# EAGLE design dnc (EAGLE 7.1.0)
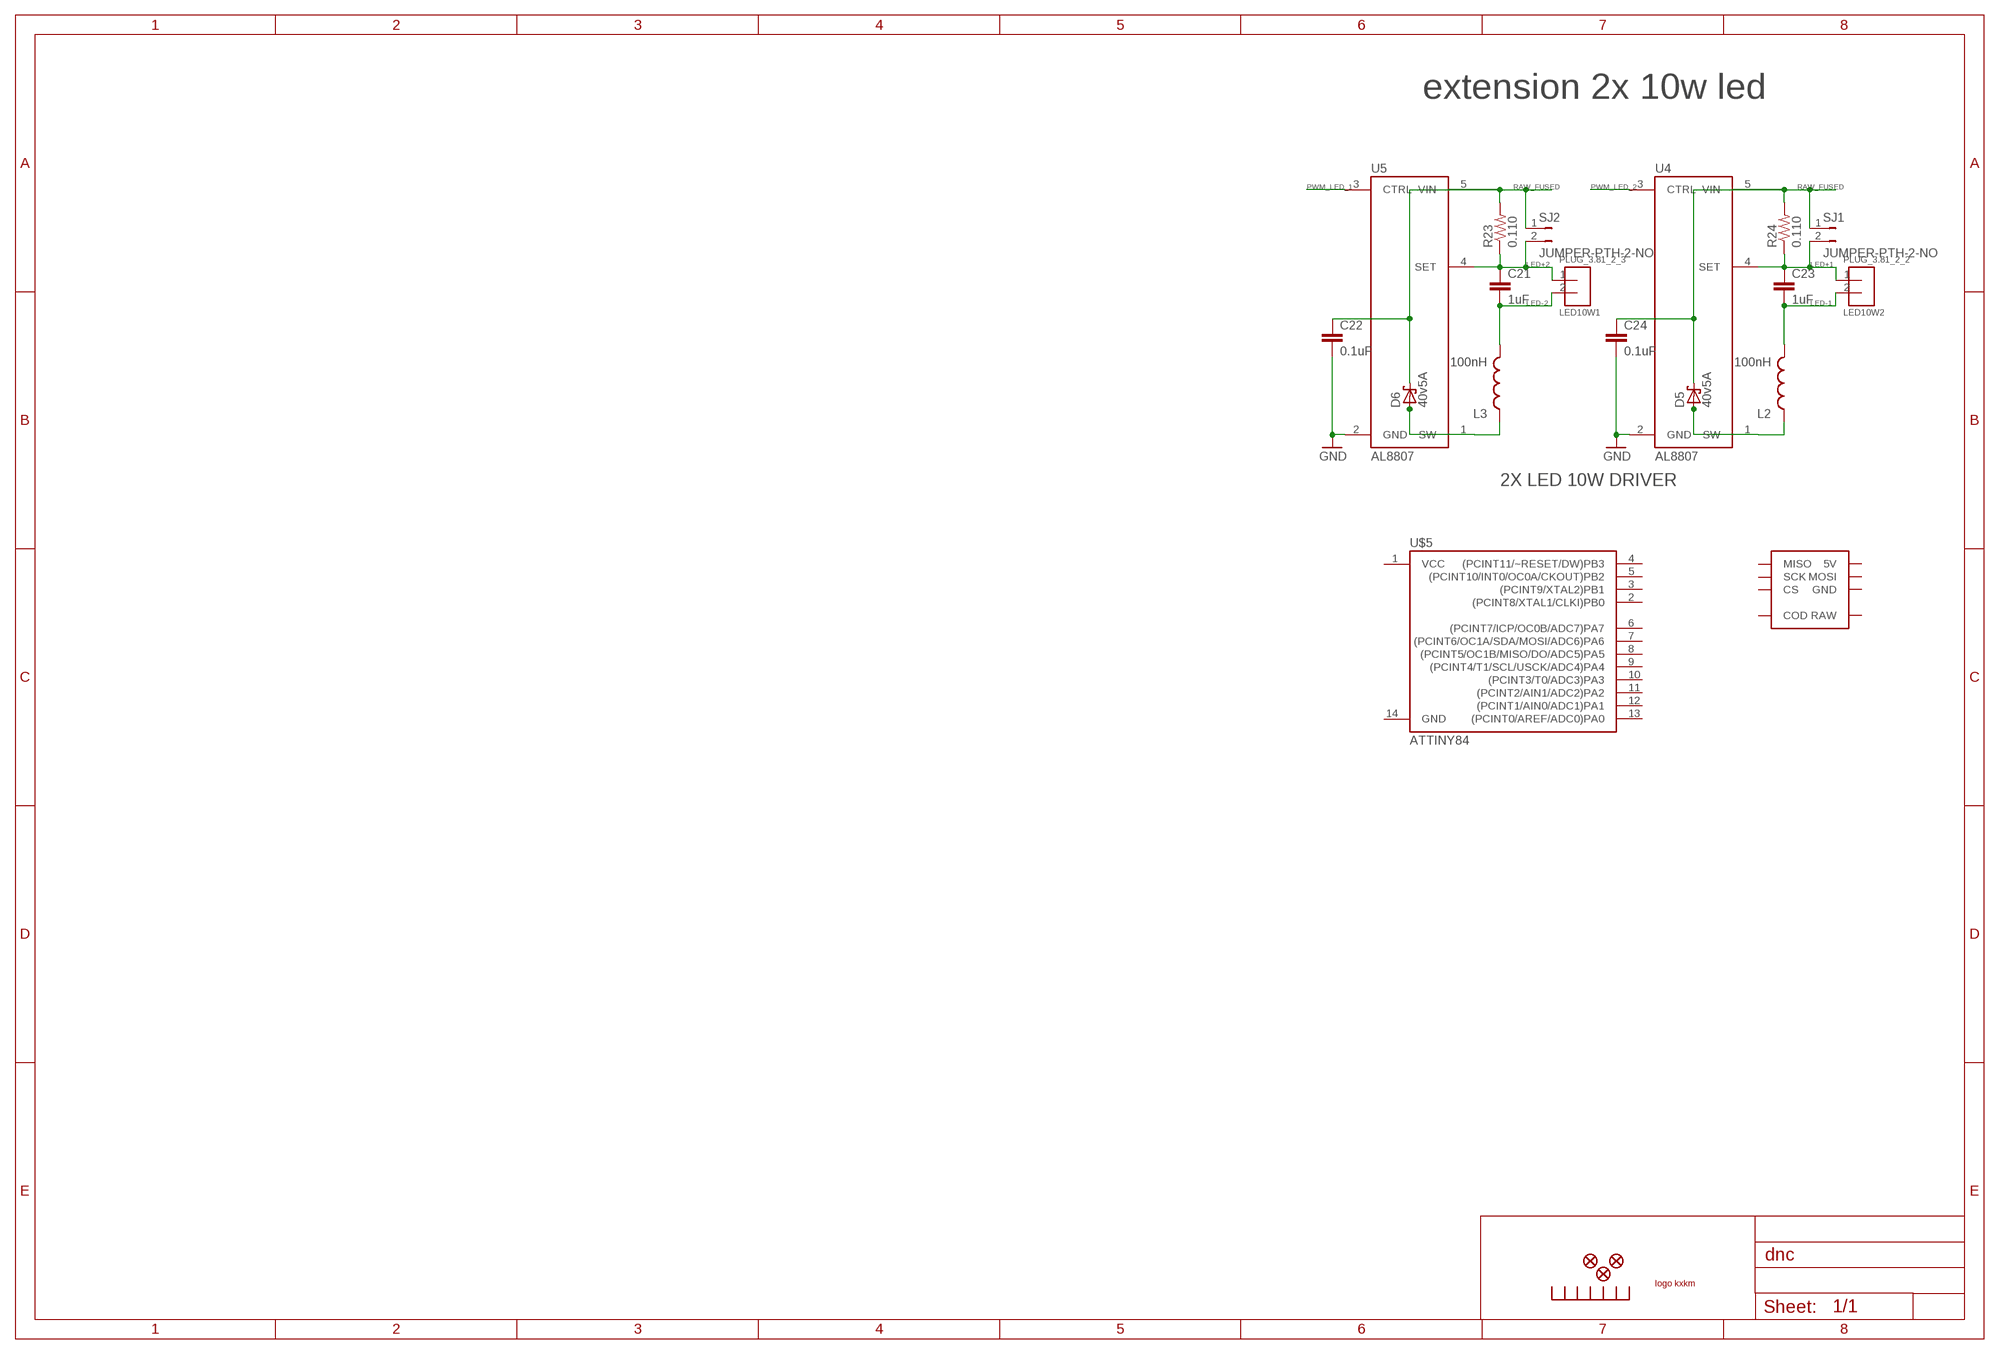
[diagram p0: schematic, sheet 1]

## Parts
C21  1uF  C-EUC0603  [C0603]
C22  0.1uF  C-EUC0603  [C0603]
C23  1uF  C-EUC0603  [C0603]
C24  0.1uF  C-EUC0603  [C0603]
D5  40v5A  SCHOTTKY-DIODESMC  [SMC]
D6  40v5A  SCHOTTKY-DIODESMC  [SMC]
JP13  FIDUCIAL1X2.5  [FIDUCIAL-1X2.5]
JP14  FIDUCIAL1X2.5  [FIDUCIAL-1X2.5]
JP19  FIDUCIAL1X2.5  [FIDUCIAL-1X2.5]
L2  100nH  INDUCTORPWR  [CDRH125]
L3  100nH  INDUCTORPWR  [CDRH125]
PLUG_3.81_2_2  LED10W2  M02PLUG  [PLUG_02]
PLUG_3.81_2_3  LED10W1  M02PLUG  [PLUG_02]
R23  0.110  RESISTOR0603-RES  [0603-RES]
R24  0.110  RESISTOR0603-RES  [0603-RES]
SJ1  JUMPER-PTH-2-NO  [PTH-JUMPER-2-NO_NO_SILK]
SJ2  JUMPER-PTH-2-NO  [PTH-JUMPER-2-NO_NO_SILK]
U4  AL8807  AL8805  [SOT23-5]
U5  AL8807  AL8805  [SOT23-5]
U$1  RADIATEUR  [RADIATEUR_577102B00000G]
U$2  LOGO  [KXKMLOGO]
U$5  ATTINY84  [SO14]
U$6  EXT-DNCCARTE_EXTENSION  [2X5_RIGHTANGLEDNC]

## Nets
GND [GND]: C22.2 C24.2 U4.2(GND) U5.2(GND)
LED+1 [5V]: C23.1 PLUG_3.81_2_2.1 R24.1 SJ1.2 U4.4(SET)
LED+2 [5V]: C21.1 PLUG_3.81_2_3.1 R23.1 SJ2.2 U5.4(SET)
LED-1 [5V]: C23.2 L2.2 PLUG_3.81_2_2.2
LED-2 [5V]: C21.2 L3.2 PLUG_3.81_2_3.2
N$22: D5.A L2.1 U4.1(SW)
N$23: D6.A L3.1 U5.1(SW)
PWM_LED_1: U5.3(CTRL)
PWM_LED_2: U4.3(CTRL)
RAW_FUSED [5V]: C22.1 C24.1 D5.C D6.C R23.2 R24.2 SJ1.1 SJ2.1 U4.5(VIN) U5.5(VIN)
Unconnected: U$5.1(VCC) U$5.2((PCINT8/XTAL1/CLKI)PB0) U$5.3((PCINT9/XTAL2)PB1) U$5.4((PCINT11/~RESET/DW)PB3) U$5.5((PCINT10/INT0/OC0A/CKOUT)PB2) U$5.6((PCINT7/ICP/OC0B/ADC7)PA7) U$5.7((PCINT6/OC1A/SDA/MOSI/ADC6)PA6) U$5.8((PCINT5/OC1B/MISO/DO/ADC5)PA5) U$5.9((PCINT4/T1/SCL/USCK/ADC4)PA4) U$5.10((PCINT3/T0/ADC3)PA3) U$5.11((PCINT2/AIN1/ADC2)PA2) U$5.12((PCINT1/AIN0/ADC1)PA1) U$5.13((PCINT0/AREF/ADC0)PA0) U$5.14(GND) U$6.5V U$6./CS(CS) U$6.GND U$6.GND2(GND) U$6.MISO U$6.MOSI U$6.RAW U$6.RAW2(RAW) U$6.RETOURANALOG(COD) U$6.SCK

## Notes on the sheet
- extension 2x 10w led
- 2X LED 10W DRIVER

## Library data of the parts
C21-C24 = rcl:C-EU: CAPACITOR, European symbol
D5 D6 = diode:SCHOTTKY-DIODE: Schottky Diode
JP13 JP14 JP19 = SparkFun:FIDUCIAL: Fiducial Alignment Points Various fiducial points for machine vision alignment.
L2 L3 = SparkFun:INDUCTOR: Inductors Basic Inductor/Choke - 0603 and 1206. Footprints are not proven and vary greatly between part numbers.
PLUG_3.81_2_2 PLUG_3.81_2_3 = pierre_vv:M02
R23 R24 = SparkFun-Passives:RESISTOR: Resistor Basic schematic elements and footprints for 0603, 1206, and PTH resistors.
SJ1 SJ2 = SparkFun-Passives:JUMPER-PTH-2-NO
U4 U5 = SparkFun-PowerIC:AL8805: Constant current LED driver PWM-able 1MHz switch freq 6V-36V Up to 1A LED current; PROD_ID: IC-11626; VALUE: AL8805WS
U$1 = pierre_vv:RADIATEUR
U$2 = pierre_vv:LOGO
U$5 = SparkFun-DigitalIC:ATTINY84: Atmel 14-pin 2/4/8kB flash uC; PROD_ID: IC-11285
U$6 = pierre_vv:EXT-DNC

## Net classes
0 default: width 0.203 mm
1 GND: width 0.254 mm
2 3.3V: width 0.203 mm
3 5V: width 0.305 mm
4 230AC: width 0.61 mm, clearance 0.305 mm

## Board
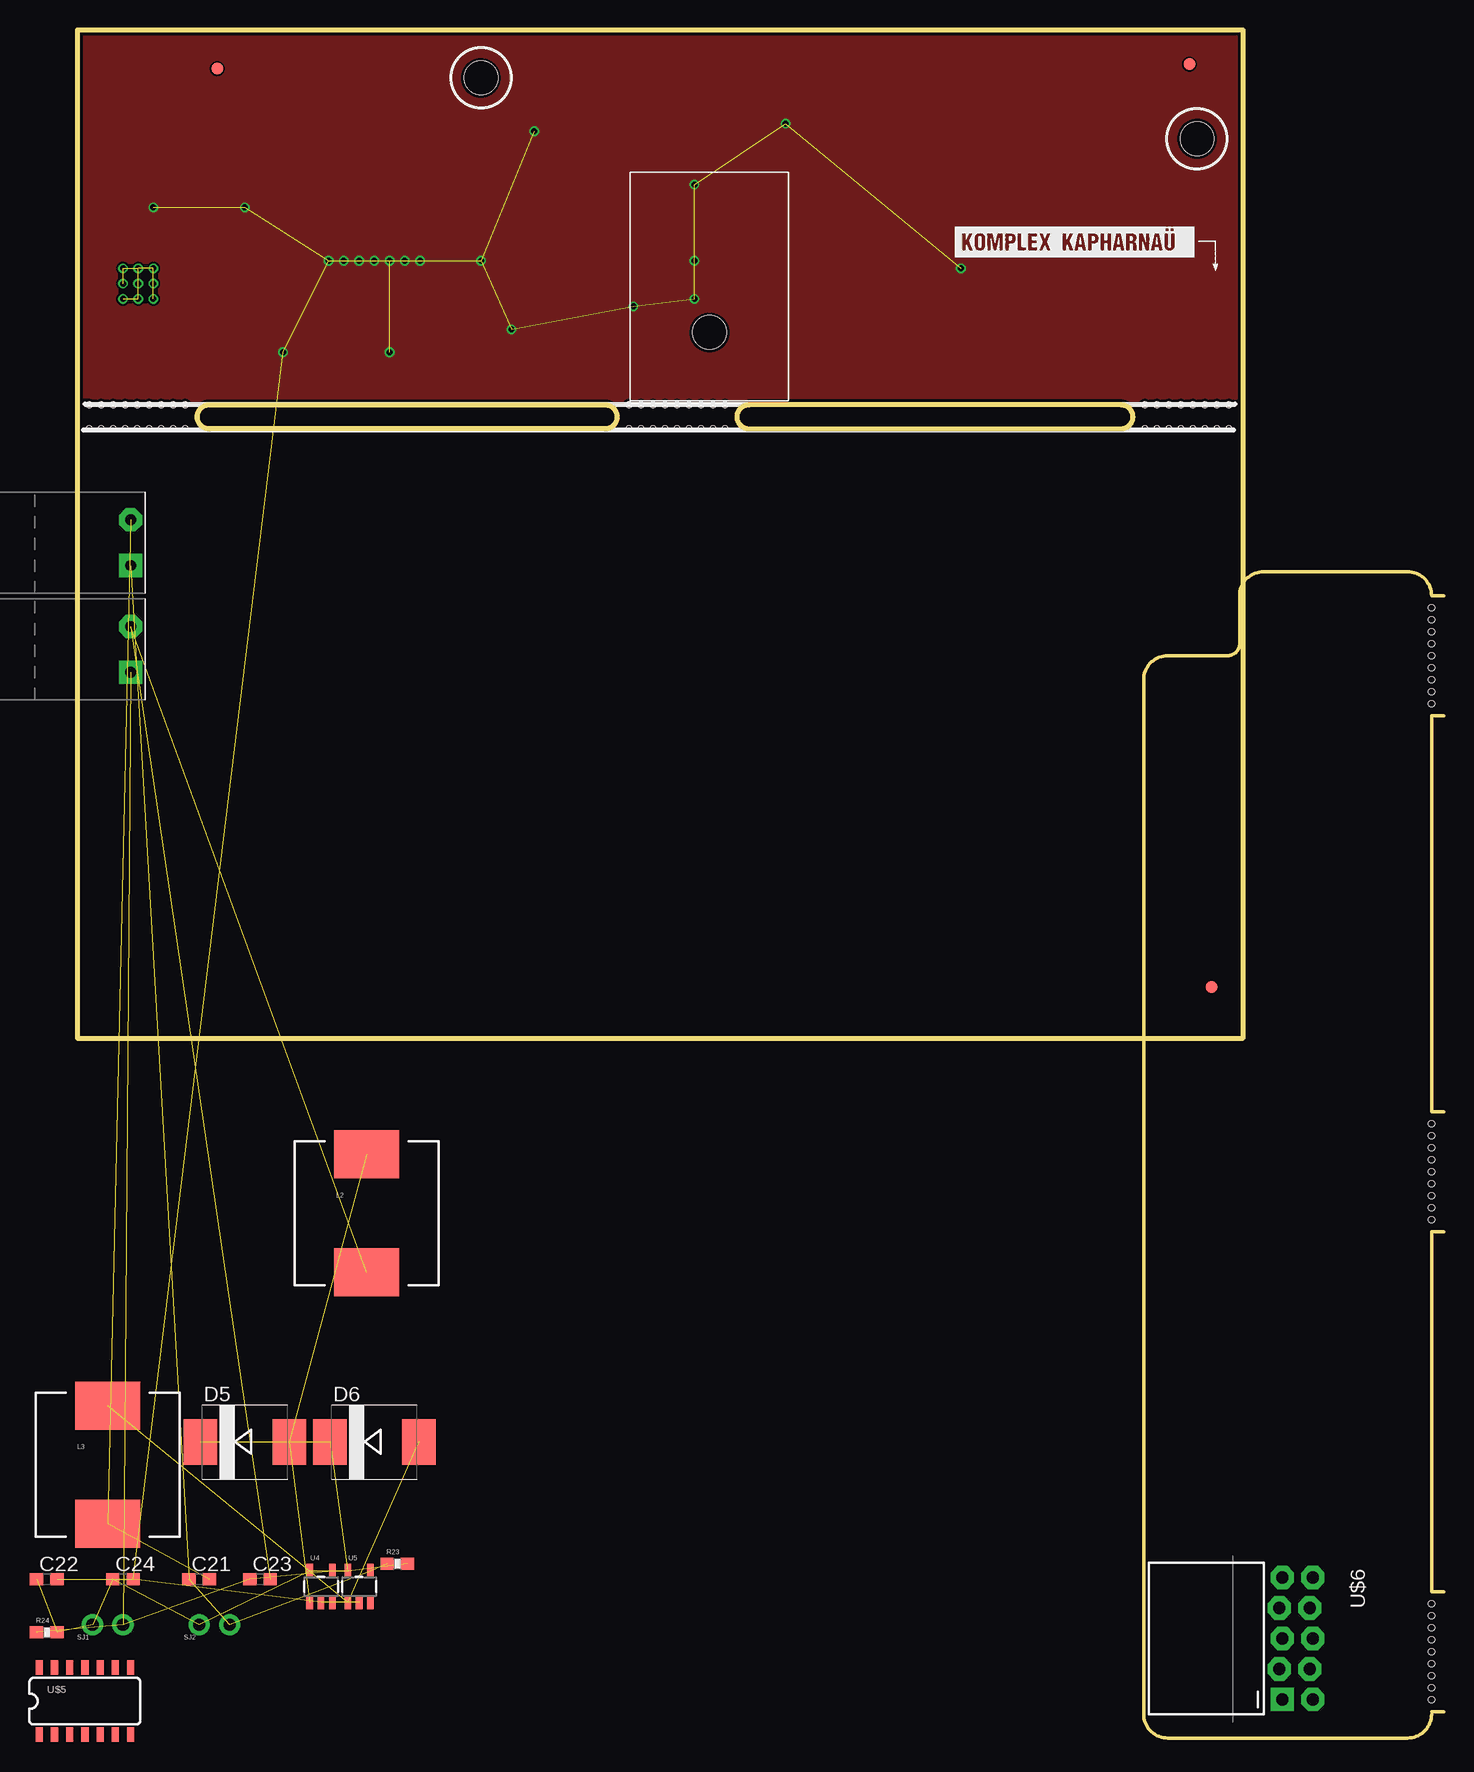
[diagram p1: board, top side]
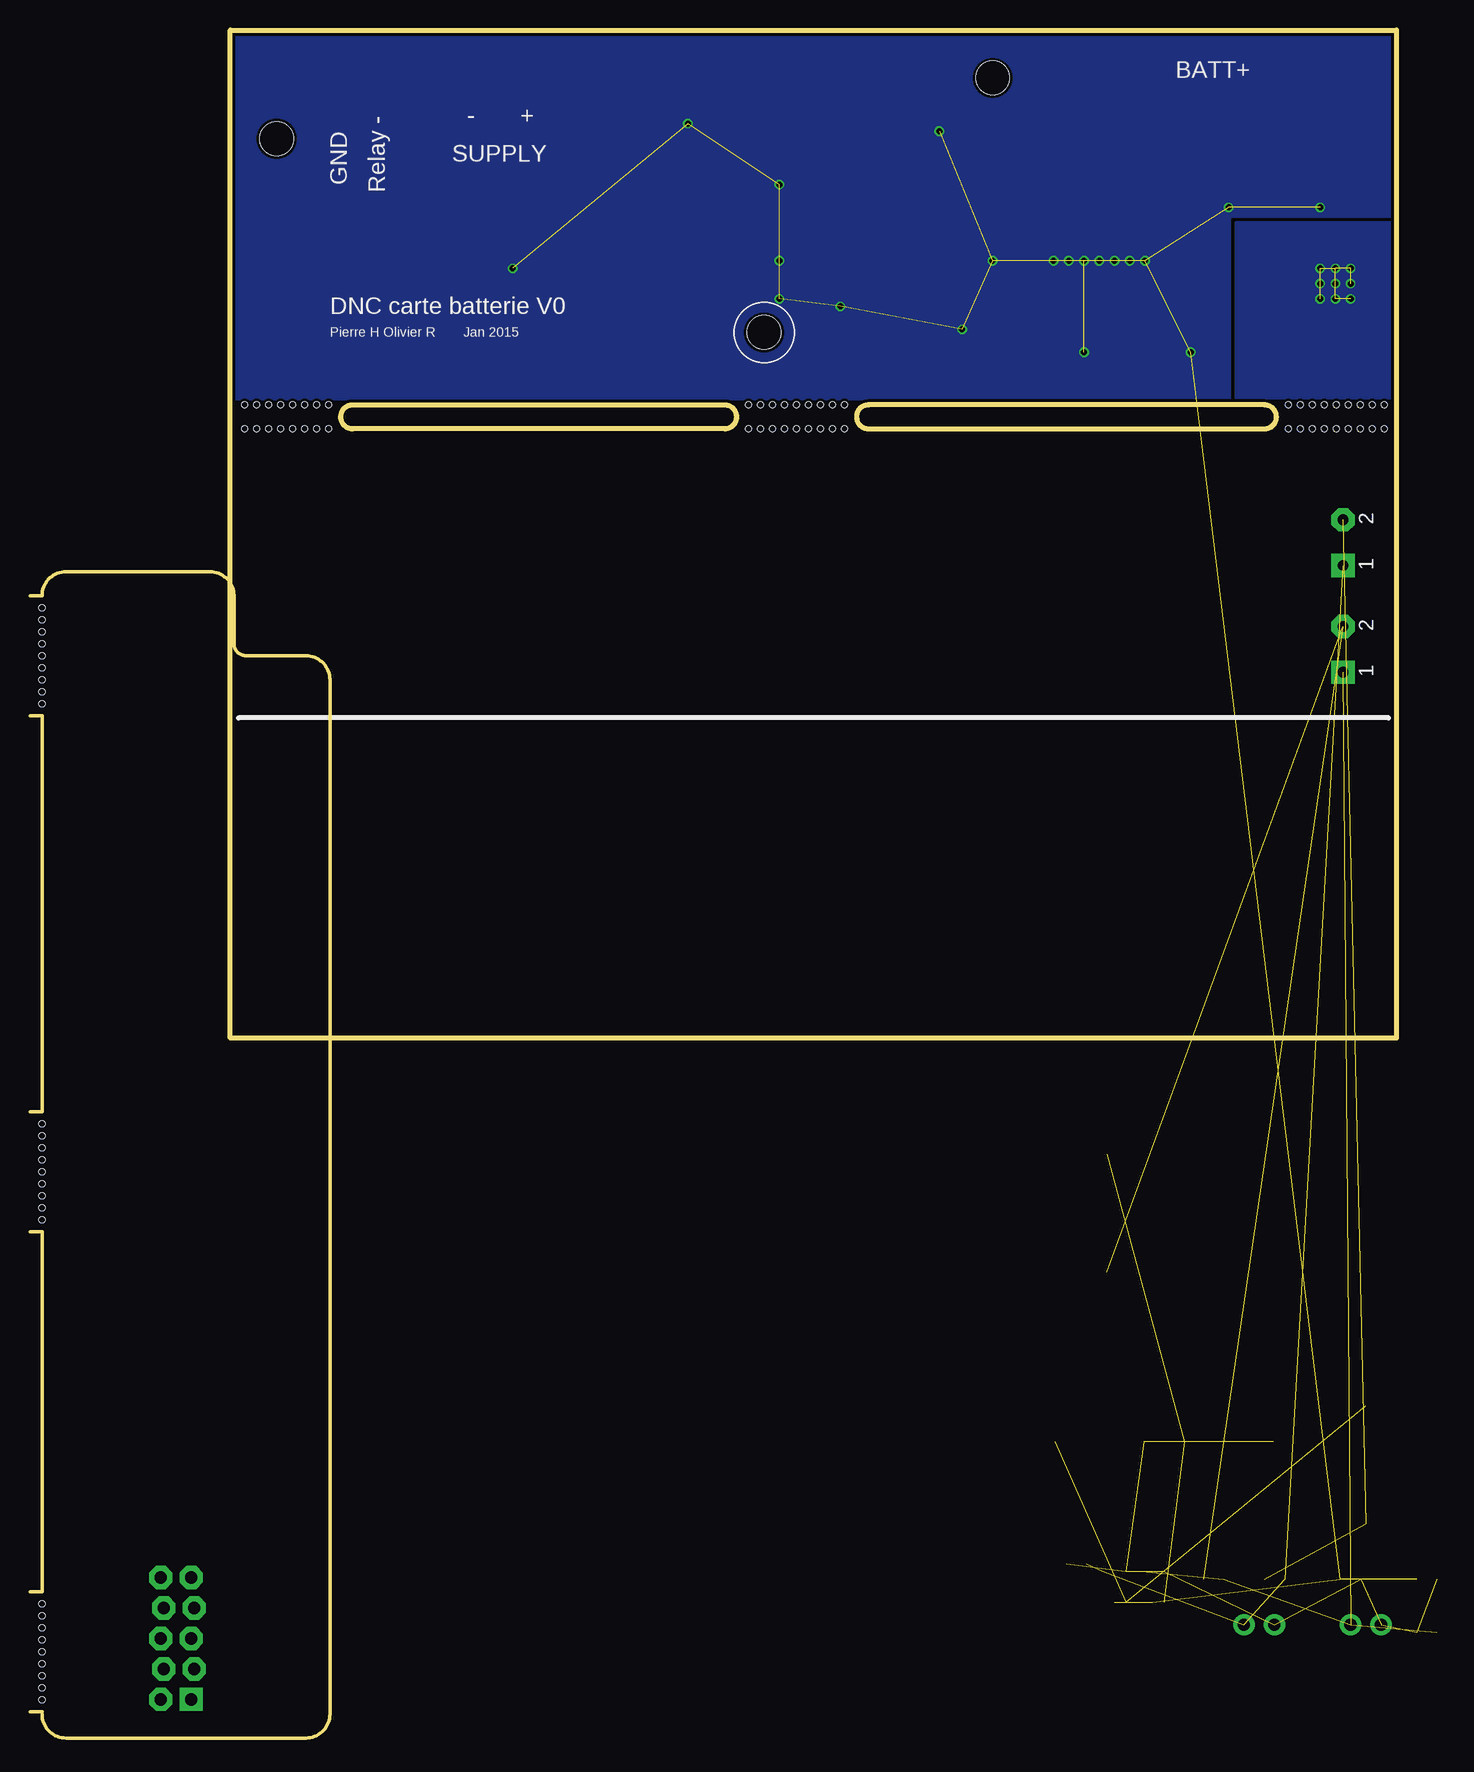
[diagram p2: board, bottom side, seen from below]

Size 113.9 x 142.34 mm. Coordinates in mm from the lower left corner, seen from the top.
Outline: 0,142.34 0,58.34 97.2,58.34 97.2,142.34 0,142.34
Outline: 11,111.1 44,111.1 arc-90 45,110.1 arc-90 44,109.1 11,109.1 arc-90 10,110.1 arc-90 11,111.1
Outline: 56,109.1 87,109.1 arc90 88,110.1 arc90 87,111.1 56,111.1 arc90 55,110.1 arc90 56,109.1
Copper layers (1*16): Top 0.035mm / dielectric 1.5mm / Bottom 0.035mm
Design rules "SeeedStudio_2layer_DRU_no_angle_20140221 *": minimum track width 6mil, minimum drill 12mil, track to track 6mil, track to pad 6mil, pad to pad 6mil, via to via 6mil, smd to smd 0mil, copper to edge 10mil, drill to drill 10mil, minimum pad ring 12mil, minimum via ring 6mil, stop-mask expansion 2mil, vias tented up to drill 100mil, thermal gap 10mil
Holes 2.8 mm at 33.66,138.35 93.34,133.27
Holes 0.5 mm at 9,109.1 8,109.1 7,109.1 7,109.1 6,109.1 5,109.1 4,109.1 3,109.1 2,109.1 1,109.1 1,111.1 2,111.1 3,111.1 4,111.1 5,111.1 6,111.1 7,111.1 8,111.1 9,111.1 46,111.1 48,111.1 47,111.1 49,111.1 50,111.1 51,111.1 52,111.1 53,111.1 54,111.1 54,109.1 53,109.1 52,109.1 51,109.1 50,109.1 49,109.1 48,109.1 47,109.1 46,109.1 96,109.1 95,109.1 94,109.1 93,109.1 92,109.1 91,109.1 90,109.1 89,109.1 89,111.1 90,111.1 91,111.1 92,111.1 93,111.1 94,111.1 95,111.1 96,111.1

### Footprints (pad centres in the part's own frame; a part is rotated, then mirrored left to right if it is on the bottom)
C0603 = smd 1.1 x 1: 1 -0.85,0; 2 0.85,0
SMC = smd 2.8 x 3.8: A 3.7,0; C -3.7,0
FIDUCIAL-1X2.5 = smd 1 x 1: 1 0,0
CDRH125 = smd 5.4 x 4: 1 0,4.9; 2 0,-4.9
PLUG_02 = drill 0.9 pad 1.93 square: 1 -1.905,0 | drill 0.9 pad 1.93 octagon: 2 1.905,0
0603-RES = smd 1.1 x 1: 1 -0.85,0; 2 0.85,0
PTH-JUMPER-2-NO_NO_SILK = drill 1.016 pad 1.778: 1 -1.27,0; 2 1.27,0
SOT23-5 = smd 0.55 x 1.2: 1 -0.95,-1.3; 2 0,-1.3; 3 0.95,-1.3; 4 0.95,1.3; 5 -0.95,1.3
RADIATEUR_577102B00000G = hole 2.8: 0,0
SO14 = smd 0.6 x 1.2: 1 -3.81,-2.8; 2 -2.54,-2.8; 3 -1.27,-2.8; 4 0,-2.8; 5 1.27,-2.8; 6 2.54,-2.8; 7 3.81,-2.8; 8 3.81,2.8; 9 2.54,2.8; 10 1.27,2.8; 11 0,2.8; 12 -1.27,2.8; 13 -2.54,2.8; 14 -3.81,2.8
2X5_RIGHTANGLEDNC = drill 1.016 pad 1.93 octagon: 5V 88.9,11.557; /CS 93.98,14.097; GND2 83.82,14.097; MISO 88.9,14.097; MOSI 91.44,11.303; RAW 86.36,11.303; RAW2 86.36,13.843; RETOURANALOG 83.82,11.557; SCK 91.44,13.843 | drill 1.016 pad 1.93 square: GND 93.98,11.557 | hole 0.5: 3,24; 4,24; 5,24; 6,24; 7,24; 8,24; 9,24; 10,24; 11,24; 46,24; 47,24; 49,24; 48,24; 50,24; 51,24; 52,24; 53,24; 54,24; 86,24; 87,24; 88,24; 90,24; 89,24; 91,24; 92,24; 93,24; 94,24

### Placement (x,y rotation side)
C21  10.16,13.25 0 top
C22  -2.54,13.25 0 top
C23  15.24,13.25 0 top
C24  3.81,13.25 0 top
D5  13.97,24.68 0 top
D6  24.77,24.68 0 top
JP13  11.68,139.11 0 top
JP14  92.71,139.49 180 top
JP19  94.56,62.57 0 top
L2  24.13,43.73 0 top
L3  2.54,22.78 0 top
PLUG_3.81_2_2  4.45,90.72 90 top
PLUG_3.81_2_3  4.45,99.61 90 top
R23  26.67,14.52 0 top
R24  -2.54,8.81 0 top
SJ1  2.54,9.44 0 top
SJ2  11.43,9.44 0 top
U4  20.32,12.62 0 top
U5  23.5,12.62 0 top
U$1  52.7,117.14 270 top
U$2  81.28,124.38 0 top
U$5  0.64,3.09 0 top
U$6  88.9,97.2 270 top

### Tracks (layer width: path | path; a pad name or v marks a point on that pad's centre or on a via)
GND  (via drill 0.5)  (23 unrouted)
  other vias: 33.66,123.11 13.97,127.55 17.14,115.49 36.2,117.39 20.95,123.11 22.23,123.11 23.5,123.11 24.77,123.11 26.04,123.11 27.3,123.11 28.57,123.11 51.44,129.46 59.05,134.54 73.66,122.47 38.1,133.9 51.44,119.93 46.35,119.3 26.04,115.49 51.44,123.11 6.35,127.55
  pour Bottom: -2.54,146.6 99.69,146.6 99.69,111.68 13.97,111.68 13.97,126.92 -2.54,126.92
  pour Top: -3.81,148.51 101.6,148.51 101.6,111.68 -3.81,111.68
LED+1  (4 unrouted)
LED+2  (4 unrouted)
LED-1  (2 unrouted)
LED-2  (2 unrouted)
N$22  (2 unrouted)
N$23  (2 unrouted)
RAW_FUSED  (9 unrouted)
SYSTEM_LOAD  (via drill 0.5)  (8 unrouted)
  other vias: 3.81,122.47 5.08,122.47 6.35,122.47 6.35,121.2 5.08,121.2 3.81,121.2 3.81,119.93 5.08,119.93 6.35,119.93
  pour Bottom: -2.54,126.28 13.34,126.28 13.34,111.68 -2.54,111.68

### Text on the board
bNames: BATT+ | Relay - | + | - | GND | SUPPLY | DNC carte batterie V0 | Pierre H Olivier R Jan 2015